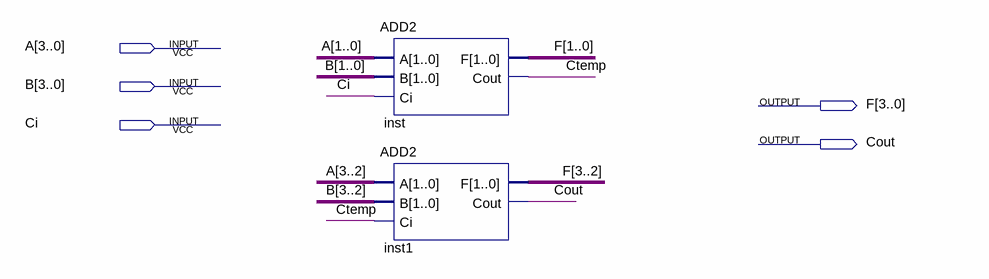
[diagram p0: schematic sheet]
// Quartus schematic ADD4.bdf as structural Verilog: 2 symbols, 5 pins
module ADD4 (
  input  [3:0] A,
  input  [3:0] B,
  input  Ci,
  output [3:0] F,
  output Cout
);

  wire Ctemp;

  ADD2 inst (.A(A[1:0]), .B(B[1:0]), .Ci(Ci), .F(F[1:0]), .Cout(Ctemp));
  ADD2 inst1 (.A(A[3:2]), .B(B[3:2]), .Ci(Ctemp), .F(F[3:2]), .Cout(Cout));
endmodule
